# Altium schematic sheet InterControlEsp32.SchDoc
size A4
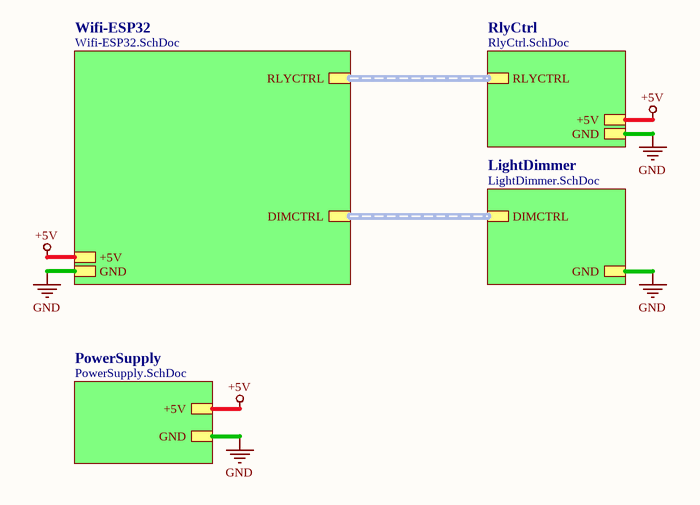
[diagram p0: InterControlEsp32.SchDoc]

## Sub-sheets
LightDimmer = LightDimmer.SchDoc: DIMCTRL (harness DIMCTRL), GND
PowerSupply = PowerSupply.SchDoc: +5V, GND
RlyCtrl = RlyCtrl.SchDoc: RLYCTRL (harness RLYCTRL), +5V, GND
Wifi-ESP32 = Wifi-ESP32.SchDoc: +5V, GND, RLYCTRL (harness RLYCTRL), DIMCTRL (harness DIMCTRL)

## Nets
+5V: sheet Wifi-ESP32/+5V, sheet RlyCtrl/+5V, sheet PowerSupply/+5V
GND: sheet Wifi-ESP32/GND, sheet RlyCtrl/GND, sheet PowerSupply/GND, sheet LightDimmer/GND

## Buses and harness runs
harness sheet LightDimmer/DIMCTRL = sheet Wifi-ESP32/DIMCTRL
harness sheet RlyCtrl/RLYCTRL = sheet Wifi-ESP32/RLYCTRL